# Altium schematic sheet TELM0001_Telemetry .SchDoc: Telemetry - Top Level
size A3; Engineer: A. SHAW; Organization: BLUEsat Project; Address1: Room 419; Address2: School of EE&T; Address3: UNSW, NSW 2052; Address4: Australia; DocumentNumber: TELM0001; SheetNumber: 1; SheetTotal: 1; Description: Telemetary Top Schematic; Version: 1.0
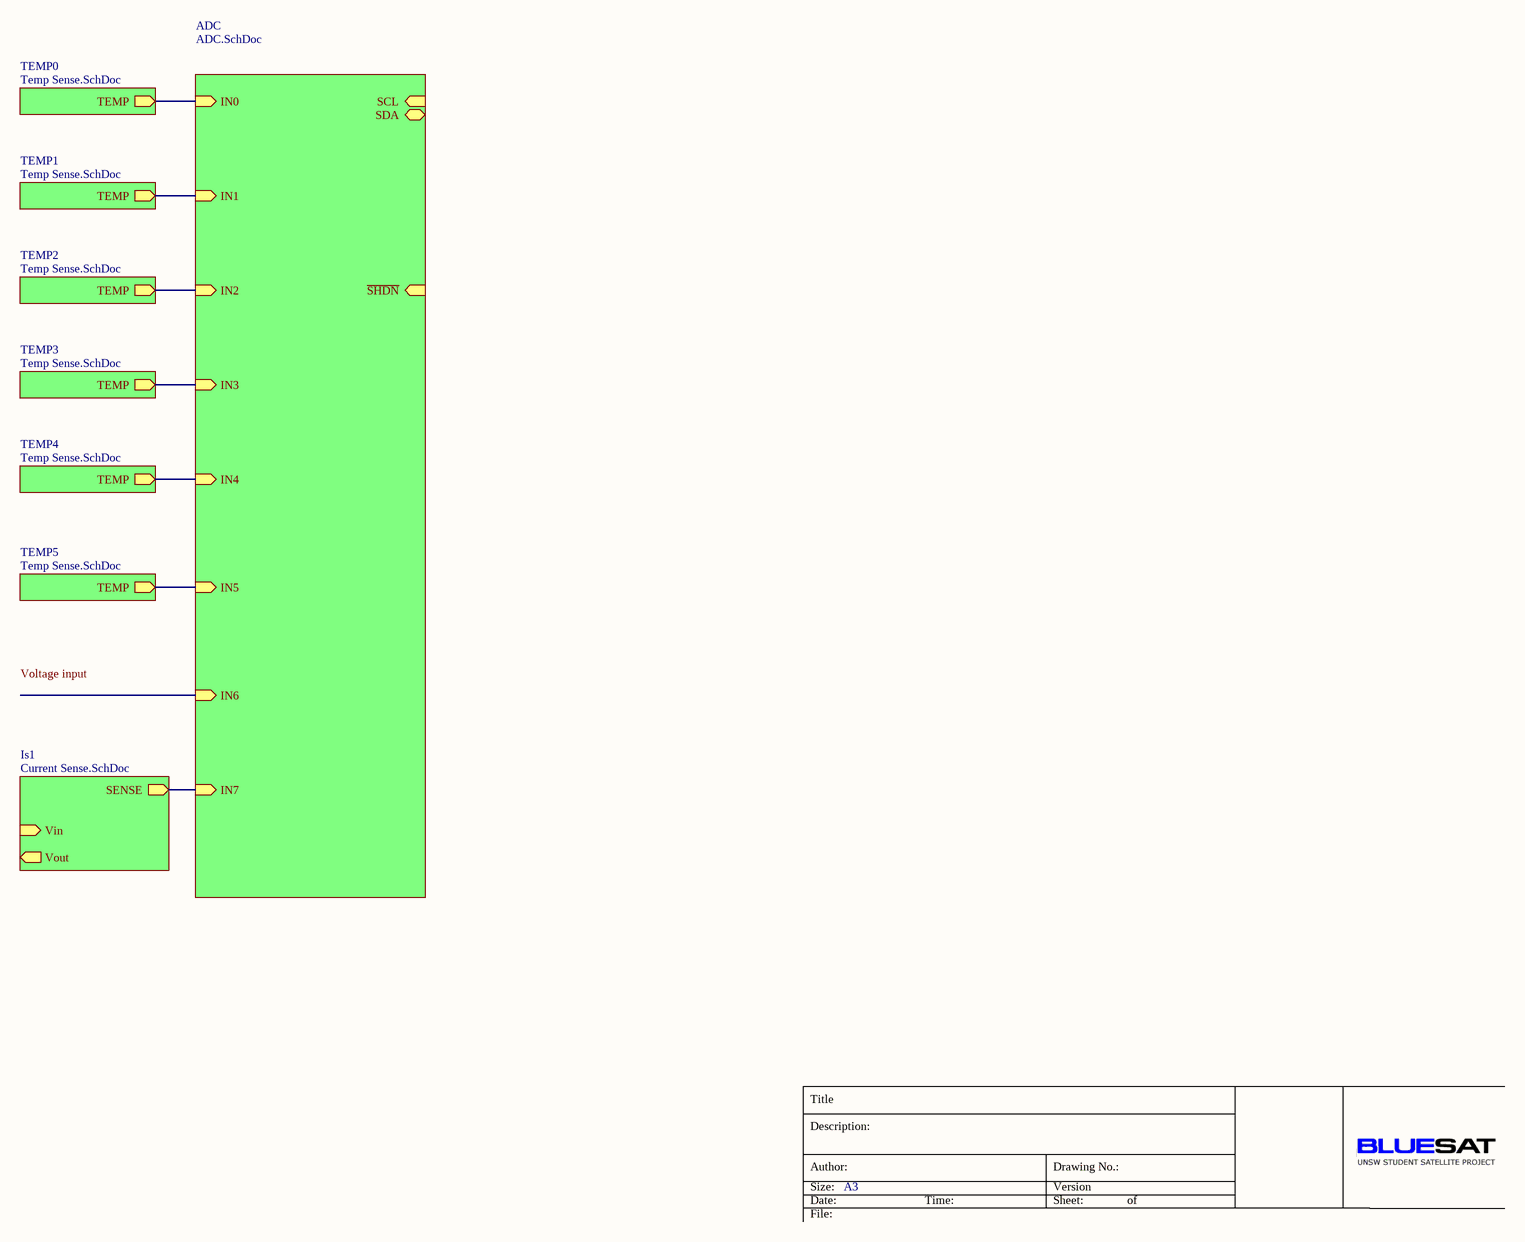
[diagram p0: TELM0001_Telemetry .SchDoc]

## Sub-sheets
ADC = ADC.SchDoc: IN0 (in), IN1 (in), IN2 (in), IN3 (in), IN4 (in), IN5 (in), IN6 (in), IN7 (in), SCL (in), SDA (bidir), ~{SHDN} (in)
Is1 = Current Sense.SchDoc: SENSE (out), Vout (out), Vin (in)
TEMP0 = Temp Sense.SchDoc: TEMP (out)
TEMP1 = Temp Sense.SchDoc: TEMP (out)
TEMP2 = Temp Sense.SchDoc: TEMP (out)
TEMP3 = Temp Sense.SchDoc: TEMP (out)
TEMP4 = Temp Sense.SchDoc: TEMP (out)
TEMP5 = Temp Sense.SchDoc: TEMP (out)

## Nets
(unnamed): sheet ADC/IN0, sheet TEMP0/TEMP
(unnamed): sheet ADC/IN1, sheet TEMP1/TEMP
(unnamed): sheet ADC/IN2, sheet TEMP2/TEMP
(unnamed): sheet ADC/IN3, sheet TEMP3/TEMP
(unnamed): sheet ADC/IN4, sheet TEMP4/TEMP
(unnamed): sheet ADC/IN5, sheet TEMP5/TEMP
(unnamed): sheet ADC/IN7, sheet Is1/SENSE

## Notes on the sheet
- Title
- Description:
- Size:
- Author:
- Date:
- A3
- Time:
- Version
- Sheet:
- Drawing No.:
- of
- File:
- Labels drawn without touching a wire or pin: Voltage input